# EAGLE schematic file-1764160802765-894161147 (EAGLE 9.7.0)
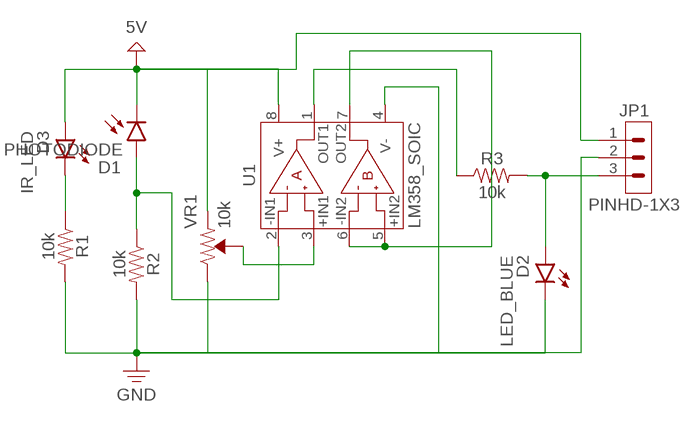
[diagram p0: schematic, sheet 1]

## Parts
D1  PHOTODIODE  [LEDRD254W51D580H541B]
D2  LED_BLUE  LED_RADIAL_BLUE  [LEDRD254W60D565H860B_B]
D3  IR_LED  LED_RADIAL_BLUE  [LEDRD254W60D565H860B_B]
JP1  PINHD-1X3  [1X03]
R1  10k  100KOHM-HORIZ-1/4W-1%  [AXIAL-0.3]
R2  10k  100KOHM-HORIZ-1/4W-1%  [AXIAL-0.3]
R3  10k  100KOHM-HORIZ-1/4W-1%  [AXIAL-0.3]
U1  LM358_SOIC  [SOIC127P600X175-8N]
VR1  10k  TRIMPOT-PTH-10MM-KNOB-1/2W-10%  [TRIMPOT-PTH-3386U]

## Nets
5V: D1.C D3.1(A) JP1.1 U1.8(V+) VR1.1(CCW)
GND: D2.2(C) JP1.2 R1.P$2 R2.P$2 U1.4(V-) VR1.3(CW)
N$1: D3.2(C) R1.P$1
N$2: D1.A R2.P$1 U1.2(-IN1)
N$3: U1.3(+IN1) VR1.2(WIPER)
N$4: R3.P$1 U1.1(OUT1)
N$5: D2.1(A) JP1.3 R3.P$2
N$6: U1.5(+IN2) U1.6(-IN2) U1.7(OUT2)

## Library data of the parts
D1 = Tinkercad:PHOTODIODE: Photodiode Reference Datasheet <https://datasheet.octopart.com/PDB-C139-Advanced-Photonix-datasheet-146011.pdf>
D2 = Tinkercad:LED_RADIAL: LED - Generic; CATEGORY: Opto-Electronic; SUB-CATEGORY: LED
D3 = Tinkercad:LED_RADIAL: LED - Generic; CATEGORY: Opto-Electronic; SUB-CATEGORY: LED; VALUE: LED_BLUE
JP1 = Connector:PINHD-1X3: Pin Header; CATEGORY: Connectors; DESCRIPTION: Header-Straight-3 Position; PACKAGE_TYPE: Through Hole; PITCH: 0.100" (2.54mm); SUBCATEGORY: Headers; TYPE: Male Pins
R1-R3 = SparkFun-Resistors:100KOHM: 100kΩ resistor A resistor is a passive two-terminal electrical component that implements electrical resistance as a circuit element. Resistors act to reduce current flow, and, at the same time, act to lower voltage levels within circuits. - Wikipedia; PROD_ID: RES-12184; VALUE: 100k
U1 = IC_Linear:LM358: Dual Operational Amplifier Reference: Datasheet <https://www.ti.com/lit/ds/symlink/lm158-n.pdf>; CATEGORY: Linear ICs; DESCRIPTION: General Purpose Amplifier 2 Circuit 8-SOIC Generic; PACKAGE_SIZE: 8-SOIC; PACKAGE_TYPE: Surface Mount; SERIES: LM358; SUBCATEGORY: Amplifiers; TYPE: General Purpose
VR1 = SparkFun-Resistors:TRIMPOT: Trimming Potentiometer (Trimpot) Three-terminal potentiometers, with an adjustable wiper and two adjustable resistors. A pot can be used to create a configurable voltage divider, or as a variable resistor. "Trimpots" are a subset of potentiometers, usually intended for "set-and-forget" applications. They're often more delicate than standard potentiometers - rated for fewer turns. Variants PTH-KNOB - PTH Trimpot w/ finger-adjustable knob Trimpot 10K with Knob <https://www.sparkfun.com/products/9806> (COM-09806) Datasheet <http://www.sparkfun.com/datasheets/Components/General/TSR-3386.pdf> SMD-3MM-CLOSED-FRAME - SMD 3mm Square Closed-Frame Trimpot Used on e.g. EasyDriver - Stepper Motor Driver <https://www.sparkfun.com/products/12779> Datasheet <http://www.bitechnologies.com/pdfs/22.pdf> (22AR10KTR) SMD-5MM - SMD 5mm Square Closed-Frame Trimpot Used on e.g. IOIO-OTG - V2.2 <https://www.sparkfun.com/products/13613> Datasheet <http://www.vishay.com/docs/51008/ts53.pdf> (TS53YL502MR10) SMD-3MM-1/10W-25% - 3mm Square Open-Frame Trimpot Used on e.g. SparkFun Shapeoko <https://www.sparkfun.com/products/13899> Datasheet <http://www.bourns.com/docs/Product-Datasheets/TC33.pdf> (TC33X-2-103E); PROD_ID: RES-09730; SF_SKU: COM-09806